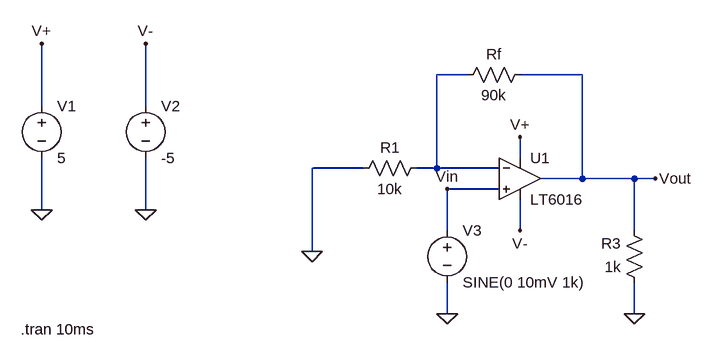
[diagram p0: schematic Lab_Task_2.asc]
Lab_Task_2.asc, the LTspice schematic file:
Version 4.1
SHEET 1 880 680
WIRE 208 0 160 0
WIRE 384 0 288 0
WIRE -448 48 -448 -48
WIRE -288 48 -288 -48
WIRE 288 128 288 96
WIRE 48 144 -32 144
WIRE 160 144 160 0
WIRE 160 144 128 144
WIRE 256 144 160 144
WIRE 384 160 384 0
WIRE 384 160 320 160
WIRE 464 160 384 160
WIRE 496 160 464 160
WIRE 256 176 176 176
WIRE -448 208 -448 128
WIRE -288 208 -288 128
WIRE 176 240 176 176
WIRE 288 240 288 192
WIRE 464 240 464 160
WIRE -32 272 -32 144
WIRE 176 368 176 320
WIRE 464 368 464 320
FLAG 176 368 0
FLAG 464 368 0
FLAG -32 272 0
FLAG 496 160 Vout
FLAG 176 176 Vin
FLAG -448 208 0
FLAG -288 208 0
FLAG -448 -48 V+
FLAG -288 -48 V-
FLAG 288 96 V+
FLAG 288 240 V-
SYMBOL OpAmps\\LT6016 288 160 R0
SYMATTR InstName U1
SYMBOL voltage 176 224 R0
SYMATTR InstName V3
SYMATTR Value SINE(0 10mV 1k)
SYMBOL res 144 128 R90
WINDOW 0 0 56 VBottom 2
WINDOW 3 32 56 VTop 2
SYMATTR InstName R1
SYMATTR Value 10k
SYMBOL res 304 -16 R90
WINDOW 0 0 56 VBottom 2
WINDOW 3 32 56 VTop 2
SYMATTR InstName Rf
SYMATTR Value 90k
SYMBOL res 480 336 R180
WINDOW 0 36 76 Left 2
WINDOW 3 36 40 Left 2
SYMATTR InstName R3
SYMATTR Value 1k
SYMBOL voltage -448 32 R0
SYMATTR InstName V1
SYMATTR Value 5
SYMBOL voltage -288 32 R0
SYMATTR InstName V2
SYMATTR Value -5
TEXT -480 392 Left 2 !.tran 10ms

The netlist it stands for:
* Lab_Task_2.asc
* U1: LT6016 (symbol OpAmps\LT6016 not available, pins judged from their places): In+=Vin In-=N001 V+=V+ V-=V- OUT=Vout
V3 Vin 0 SINE(0 10mV 1k)
R1 N001 0 10k
Rf Vout N001 90k
R3 0 Vout 1k
V1 V+ 0 5
V2 V- 0 -5
.tran 10ms
.backanno
.end